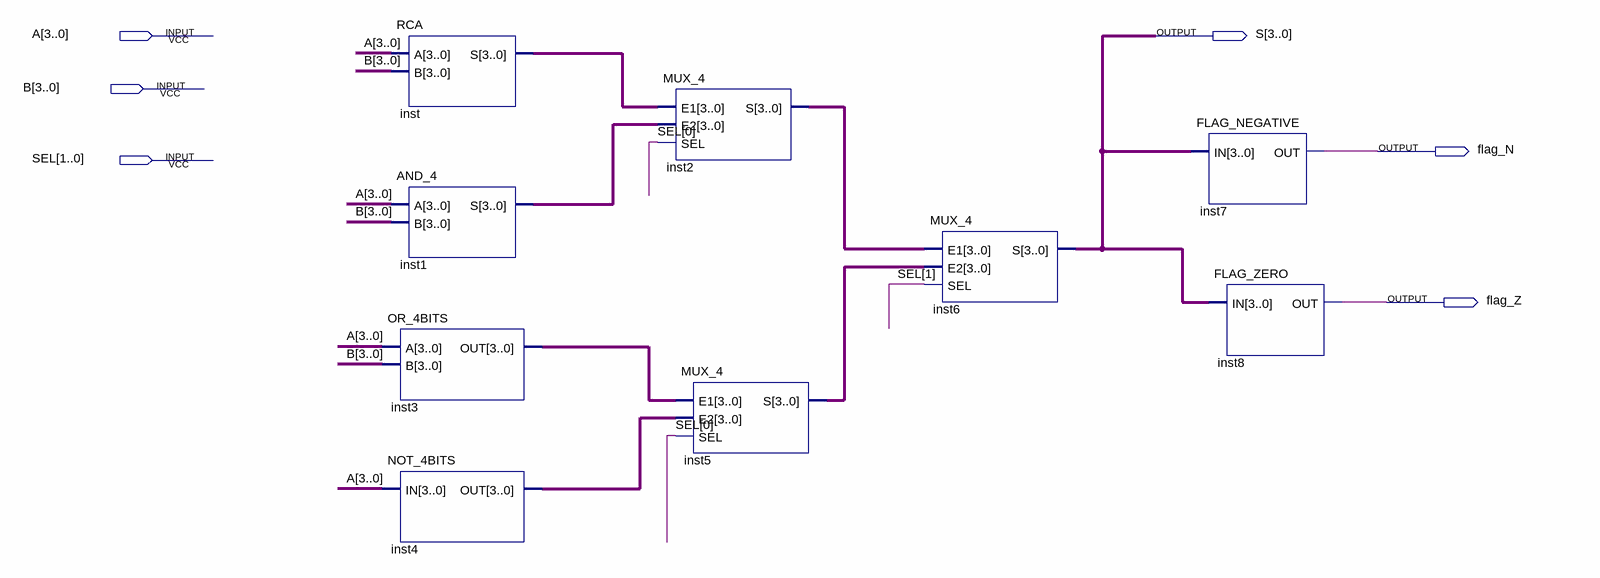
[diagram p0: schematic sheet]
// Quartus schematic ULA.bdf as structural Verilog: 9 symbols, 6 pins
module ULA (
  input  [3:0] A,
  input  [3:0] B,
  input  [1:0] SEL,
  output [3:0] S,
  output flag_N,
  output flag_Z
);

  wire [3:0] inst1_s, inst2_s, inst3_out, inst4_out, inst5_s, inst_s;

  RCA inst (.A(A), .B(B), .S(inst_s));
  AND_4 inst1 (.A(A), .B(B), .S(inst1_s));
  OR_4BITS inst3 (.A(A), .B(B), .OUT(inst3_out));
  NOT_4BITS inst4 (.IN(A), .OUT(inst4_out));
  MUX_4 inst2 (.E1(inst_s), .E2(inst1_s), .SEL(SEL[0]), .S(inst2_s));
  MUX_4 inst5 (.E1(inst3_out), .E2(inst4_out), .SEL(SEL[0]), .S(inst5_s));
  MUX_4 inst6 (.E1(inst2_s), .E2(inst5_s), .SEL(SEL[1]), .S(S));
  FLAG_NEGATIVE inst7 (.IN(S), .OUT(flag_N));
  FLAG_ZERO inst8 (.IN(S), .OUT(flag_Z));
endmodule
